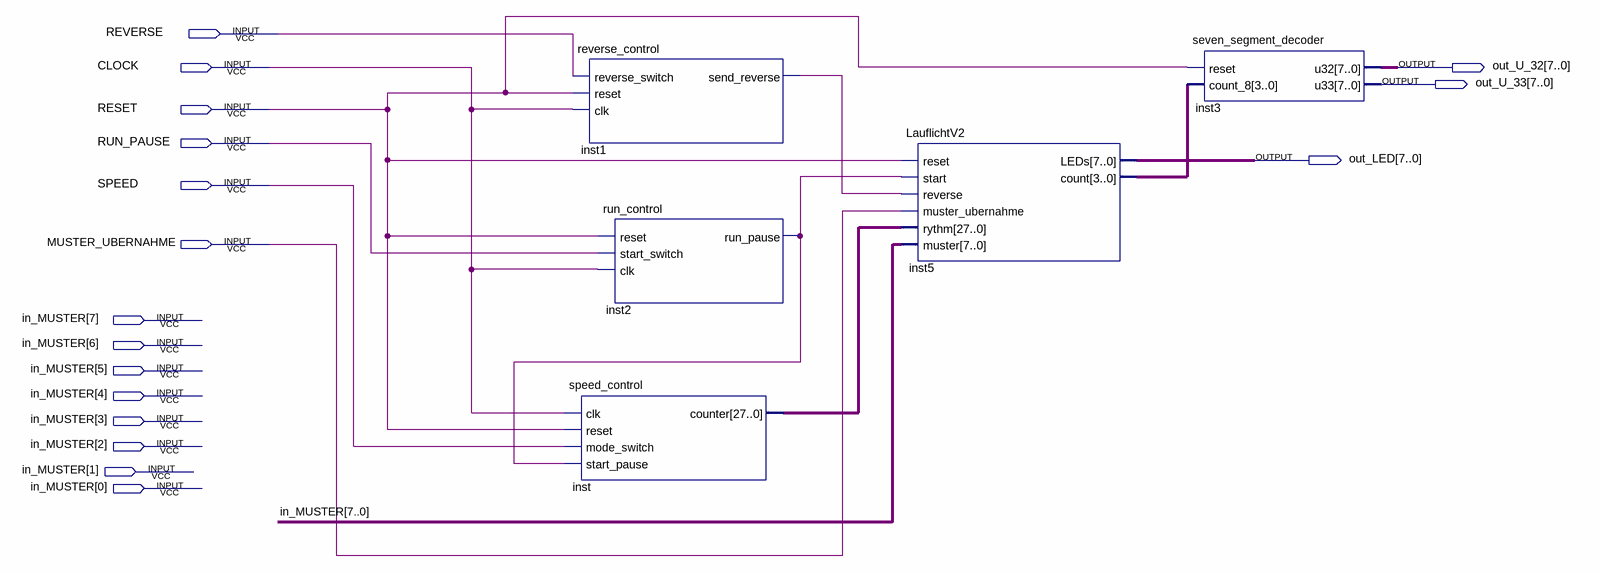
[diagram p0: schematic sheet]
// Quartus schematic Lauflicht_Final.bdf as structural Verilog: 5 symbols, 17 pins
module Lauflicht_Final (
  input  REVERSE,
  input  CLOCK,
  input  RESET,
  input  RUN_PAUSE,
  input  SPEED,
  input  MUSTER_UBERNAHME,
  input  [7:0] in_MUSTER,
  output [7:0] out_U_32,
  output [7:0] out_U_33,
  output [7:0] out_LED
);

  wire inst1_send_reverse, inst2_run_pause;
  wire [3:0] inst5_count;
  wire [27:0] inst_counter;

  reverse_control inst1 (.reverse_switch(REVERSE), .reset(RESET), .clk(CLOCK), .send_reverse(inst1_send_reverse));
  run_control inst2 (.reset(RESET), .start_switch(RUN_PAUSE), .clk(CLOCK), .run_pause(inst2_run_pause));
  speed_control inst (
    .clk(CLOCK), .reset(RESET), .mode_switch(SPEED), .start_pause(inst2_run_pause), .counter(inst_counter));
  LauflichtV2 inst5 (
    .reset(RESET), .start(inst2_run_pause), .reverse(inst1_send_reverse),
    .muster_ubernahme(MUSTER_UBERNAHME), .rythm(inst_counter), .muster(in_MUSTER), .LEDs(out_LED),
    .count(inst5_count));
  seven_segment_decoder inst3 (.reset(RESET), .count_8(inst5_count), .u32(out_U_32), .u33(out_U_33));
endmodule
